# Altium schematic sheet 2 - FPGA.SchDoc
size A3; PageSetup: Record=PageOptions|CenterHorizontal=True|CenterVertical=True|PrintScale=0.98|XCorrection=1.00|YCorrection=1.00|PrintKind=1|BorderSize=5000000|LeftOffset=0|BottomOffset=0|Orientation=2|PaperLength=1000|PaperWidth=1000|Scale=100|PaperSource=7|PrintQuality=-4|MediaType=1|DitherType=10|PaperKind=A4 (210 x 297 mm)|PrintScaleMode=1
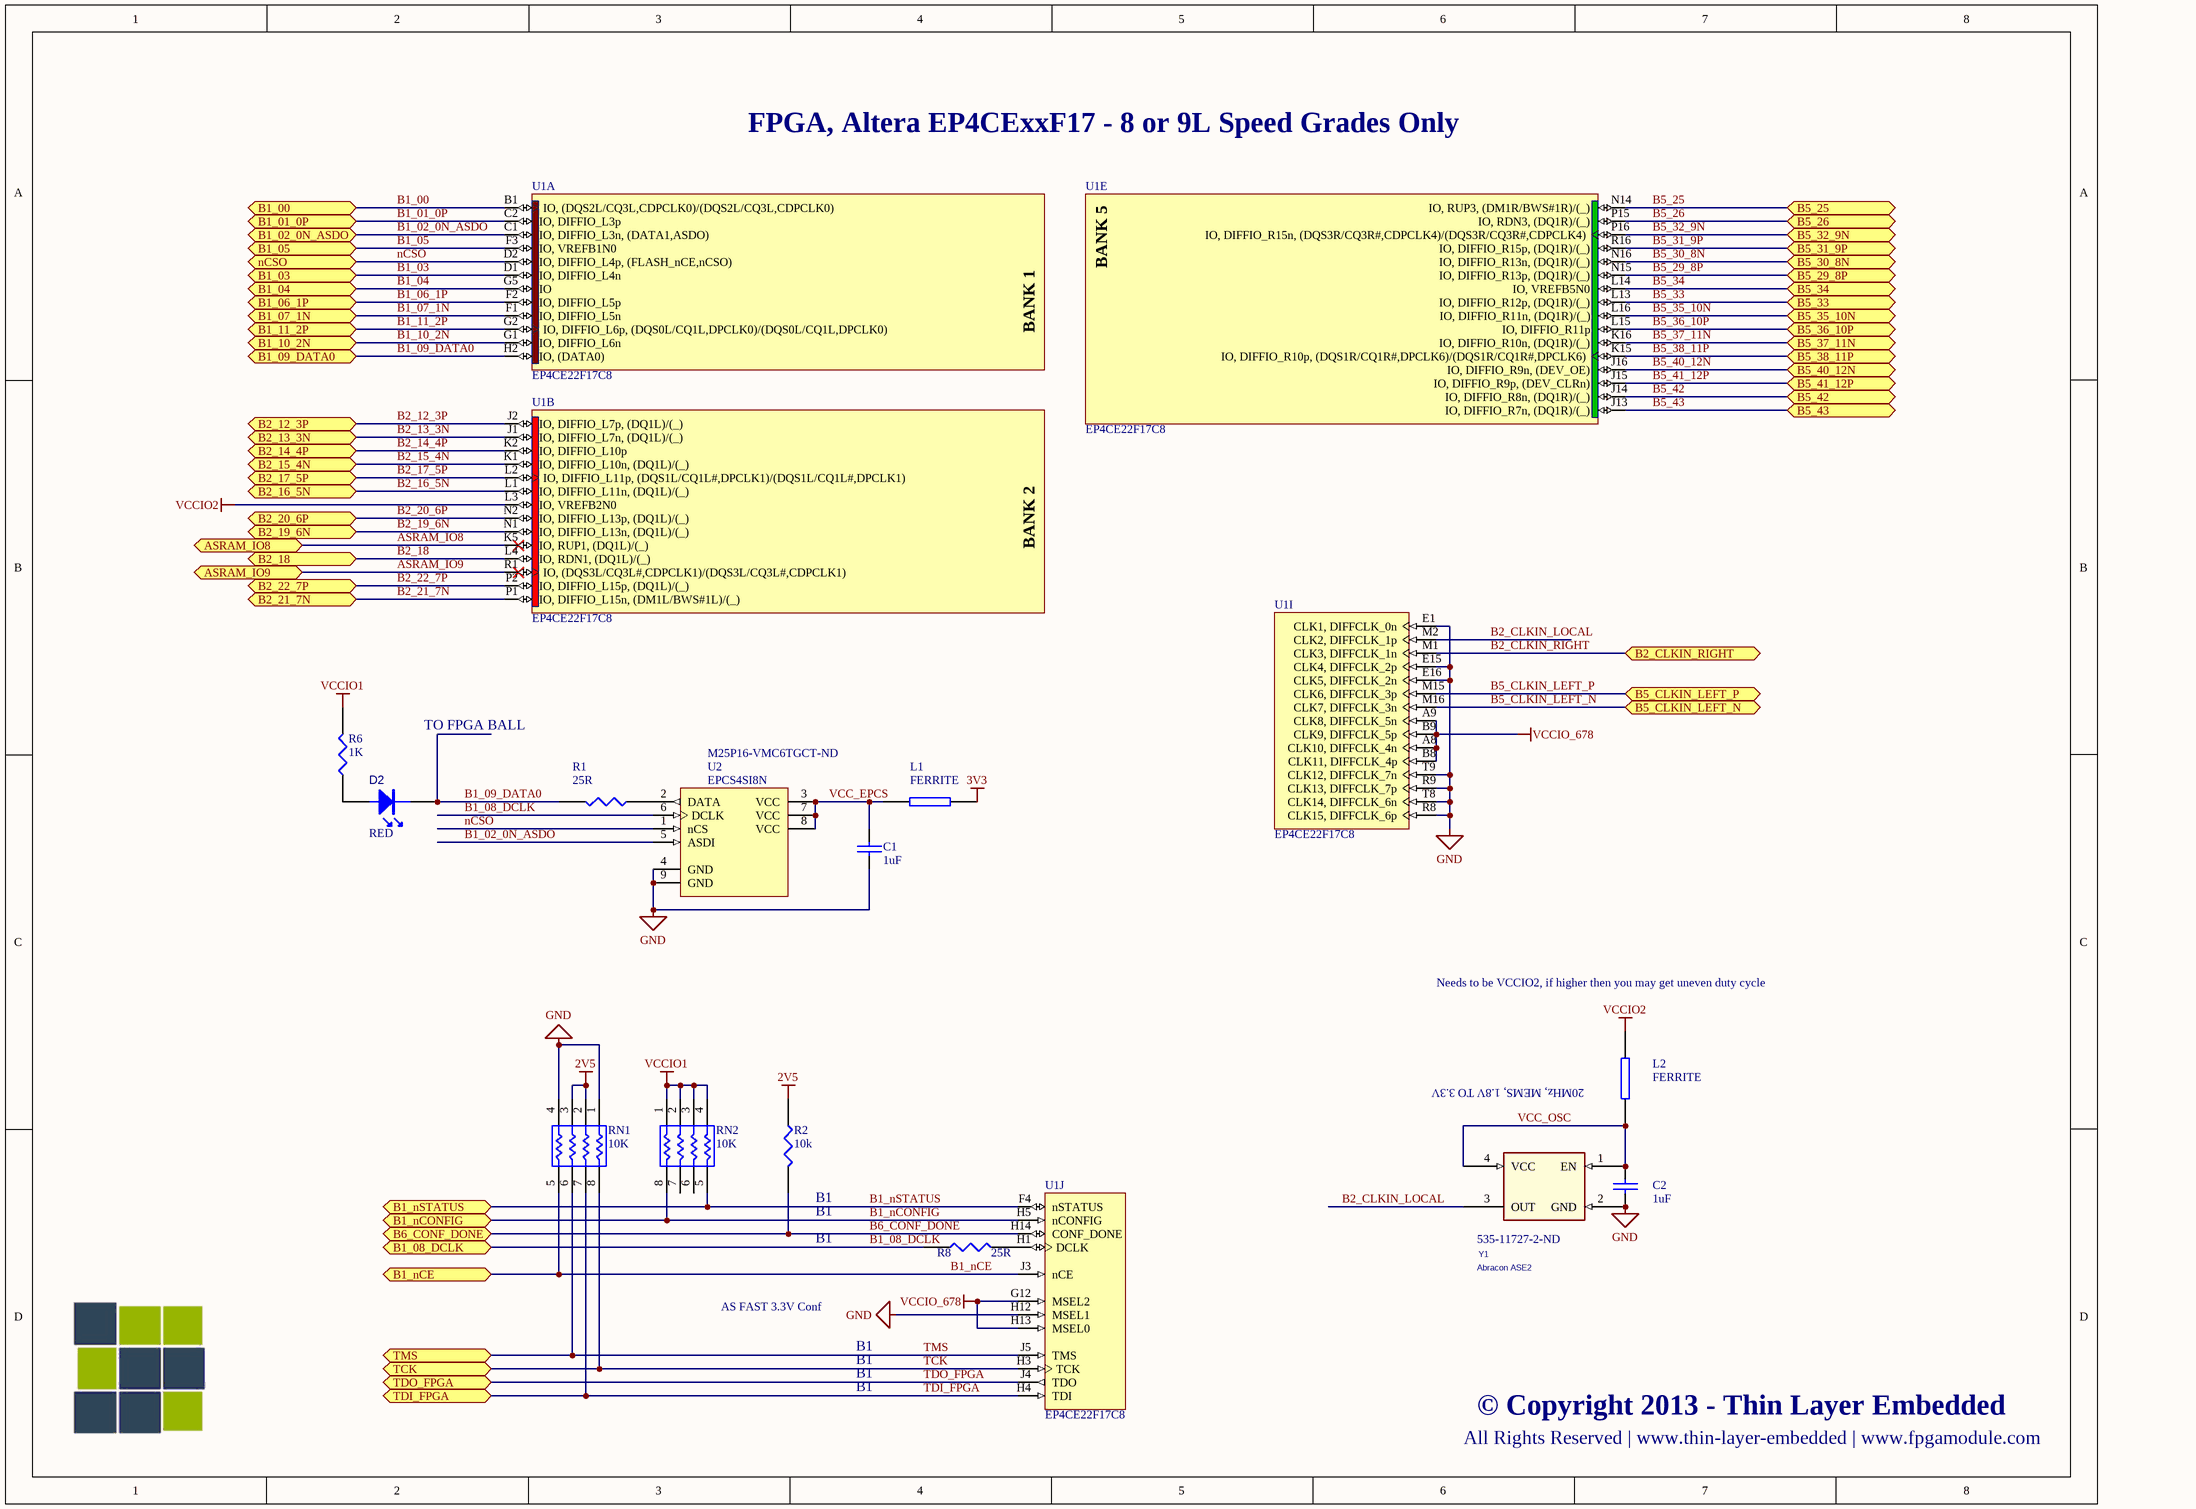
[diagram p0: 2 - FPGA.SchDoc]

## Parts
C1  1uF  [0402_hd]
C2  1uF  [0402_hd]
D2  RED  [0402LED_HD]
L1  FERRITE  [0402_HD]
L2  FERRITE  [0402_HD]
R1  25R  [0402_HD]
R2  10k  [0402_HD]
R6  1K  [0402_HD]
R8  25R  [0402_HD]
RN1  10K  [0402x4_hd]
RN2  10K  [0402x4_hd]
U1  EP4CE22F17C8  [FBGA256]  (parts A,B,E,I,J of 13)
U2  EPCS4SI8N  Supplier Part Number 1: M25P16-VMC6TGCT-ND  [UFDFPN8_4X3]
Y1  Abracon ASE2  Supplier Part Number 1: 535-11727-2-ND  [XTAL_ASDMB]

## Ports
ASRAM_IO8, ASRAM_IO9, B1_00, B1_01_0P, B1_02_0N_ASDO, B1_03, B1_04, B1_05, B1_06_1P, B1_07_1N, B1_08_DCLK, B1_09_DATA0, B1_10_2N, B1_11_2P, B1_nCE, B1_nCONFIG, B1_nSTATUS, B2_12_3P, B2_13_3N, B2_14_4P, B2_15_4N, B2_16_5N, B2_17_5P, B2_18, B2_19_6N, B2_20_6P, B2_21_7N, B2_22_7P, B2_CLKIN_RIGHT, B5_25, B5_26, B5_29_8P, B5_30_8N, B5_31_9P, B5_32_9N, B5_33, B5_34, B5_35_10N, B5_36_10P, B5_37_11N, B5_38_11P, B5_40_12N, B5_41_12P, B5_42, B5_43, B5_CLKIN_LEFT_N, B5_CLKIN_LEFT_P, B6_CONF_DONE, nCSO, TCK, TDI_FPGA, TDO_FPGA, TMS

## Nets
2V5: R2.2 RN1.2 RN1.3
3V3: L1.2
GND: C1.2 C2.2 RN1.1 RN1.4 U1.E1(CLK1,_DIFFCLK_0n) U1.E15(CLK4,_DIFFCLK_2p) U1.E16(CLK5,_DIFFCLK_2n) U1.H12(MSEL1) U1.R8(CLK15,_DIFFCLK_6p) U1.R9(CLK13,_DIFFCLK_7p) U1.T8(CLK14,_DIFFCLK_6n) U1.T9(CLK12,_DIFFCLK_7n) U2.4(GND) U2.9(GND) Y1.2(GND)
VCCIO1: R6.1 RN2.1 RN2.2 RN2.3 RN2.4
VCCIO2: L2.2 U1.L3(IO,_VREFB2N0)
VCCIO_678: U1.A8(CLK10,_DIFFCLK_4n) U1.A9(CLK8,_DIFFCLK_5n) U1.B8(CLK11,_DIFFCLK_4p) U1.B9(CLK9,_DIFFCLK_5p) U1.G12(MSEL2) U1.H13(MSEL0)
ASRAM_IO8: U1.K5(IO,_RUP1,_(DQ1L)/(_)) ; port ASRAM_IO8
ASRAM_IO9: U1.R1(IO,_(DQS3L/CQ3L#,CDPCLK1)/(DQS3L/CQ3L#,CDPCLK1)) ; port ASRAM_IO9
B1_00: U1.B1(IO,_(DQS2L/CQ3L,CDPCLK0)/(DQS2L/CQ3L,CDPCLK0)) ; port B1_00
B1_01_0P: U1.C2(IO,_DIFFIO_L3p) ; port B1_01_0P
B1_02_0N_ASDO: U1.C1(IO,_DIFFIO_L3n,_(DATA1,ASDO)) U2.5(ASDI) ; port B1_02_0N_ASDO
B1_03: U1.D1(IO,_DIFFIO_L4n) ; port B1_03
B1_04: U1.G5(IO) ; port B1_04
B1_05: U1.F3(IO,_VREFB1N0) ; port B1_05
B1_06_1P: U1.F2(IO,_DIFFIO_L5p) ; port B1_06_1P
B1_07_1N: U1.F1(IO,_DIFFIO_L5n) ; port B1_07_1N
B1_08_DCLK: R8.1 U2.6(DCLK) ; port B1_08_DCLK
B1_09_DATA0: D2.K R1.1 U1.H2(IO,_(DATA0)) ; port B1_09_DATA0
B1_10_2N: U1.G1(IO,_DIFFIO_L6n) ; port B1_10_2N
B1_11_2P: U1.G2(IO,_DIFFIO_L6p,_(DQS0L/CQ1L,DPCLK0)/(DQS0L/CQ1L,DPCLK0)) ; port B1_11_2P
B1_nCE: RN1.5 U1.J3(nCE) ; port B1_nCE
B1_nCONFIG: RN2.8 U1.H5(nCONFIG) ; port B1_nCONFIG
B1_nSTATUS: RN2.5 U1.F4(nSTATUS) ; port B1_nSTATUS
B2_12_3P: U1.J2(IO,_DIFFIO_L7p,_(DQ1L)/(_)) ; port B2_12_3P
B2_13_3N: U1.J1(IO,_DIFFIO_L7n,_(DQ1L)/(_)) ; port B2_13_3N
B2_14_4P: U1.K2(IO,_DIFFIO_L10p) ; port B2_14_4P
B2_15_4N: U1.K1(IO,_DIFFIO_L10n,_(DQ1L)/(_)) ; port B2_15_4N
B2_16_5N: U1.L1(IO,_DIFFIO_L11n,_(DQ1L)/(_)) ; port B2_16_5N
B2_17_5P: U1.L2(IO,_DIFFIO_L11p,_(DQS1L/CQ1L#,DPCLK1)/(DQS1L/CQ1L#,DPCLK1)) ; port B2_17_5P
B2_18: U1.L4(IO,_RDN1,_(DQ1L)/(_)) ; port B2_18
B2_19_6N: U1.N1(IO,_DIFFIO_L13n,_(DQ1L)/(_)) ; port B2_19_6N
B2_20_6P: U1.N2(IO,_DIFFIO_L13p,_(DQ1L)/(_)) ; port B2_20_6P
B2_21_7N: U1.P1(IO,_DIFFIO_L15n,_(DM1L/BWS#1L)/(_)) ; port B2_21_7N
B2_22_7P: U1.P2(IO,_DIFFIO_L15p,_(DQ1L)/(_)) ; port B2_22_7P
B2_CLKIN_LOCAL: U1.M2(CLK2,_DIFFCLK_1p) Y1.3(OUT)
B2_CLKIN_RIGHT: U1.M1(CLK3,_DIFFCLK_1n) ; port B2_CLKIN_RIGHT
B5_25: U1.N14(IO,_RUP3,_(DM1R/BWS#1R)/(_)) ; port B5_25
B5_26: U1.P15(IO,_RDN3,_(DQ1R)/(_)) ; port B5_26
B5_29_8P: U1.N15(IO,_DIFFIO_R13p,_(DQ1R)/(_)) ; port B5_29_8P
B5_30_8N: U1.N16(IO,_DIFFIO_R13n,_(DQ1R)/(_)) ; port B5_30_8N
B5_31_9P: U1.R16(IO,_DIFFIO_R15p,_(DQ1R)/(_)) ; port B5_31_9P
B5_32_9N: U1.P16(IO,_DIFFIO_R15n,_(DQS3R/CQ3R#,CDPCLK4)/(DQS3R/CQ3R#,CDPCLK4)) ; port B5_32_9N
B5_33: U1.L13(IO,_DIFFIO_R12p,_(DQ1R)/(_)) ; port B5_33
B5_34: U1.L14(IO,_VREFB5N0) ; port B5_34
B5_35_10N: U1.L16(IO,_DIFFIO_R11n,_(DQ1R)/(_)) ; port B5_35_10N
B5_36_10P: U1.L15(IO,_DIFFIO_R11p) ; port B5_36_10P
B5_37_11N: U1.K16(IO,_DIFFIO_R10n,_(DQ1R)/(_)) ; port B5_37_11N
B5_38_11P: U1.K15(IO,_DIFFIO_R10p,_(DQS1R/CQ1R#,DPCLK6)/(DQS1R/CQ1R#,DPCLK6)) ; port B5_38_11P
B5_40_12N: U1.J16(IO,_DIFFIO_R9n,_(DEV_OE)) ; port B5_40_12N
B5_41_12P: U1.J15(IO,_DIFFIO_R9p,_(DEV_CLRn)) ; port B5_41_12P
B5_42: U1.J14(IO,_DIFFIO_R8n,_(DQ1R)/(_)) ; port B5_42
B5_43: U1.J13(IO,_DIFFIO_R7n,_(DQ1R)/(_)) ; port B5_43
B5_CLKIN_LEFT_N: U1.M16(CLK7,_DIFFCLK_3n) ; port B5_CLKIN_LEFT_N
B5_CLKIN_LEFT_P: U1.M15(CLK6,_DIFFCLK_3p) ; port B5_CLKIN_LEFT_P
B6_CONF_DONE: R2.1 U1.H14(CONF_DONE) ; port B6_CONF_DONE
nCSO: U1.D2(IO,_DIFFIO_L4p,_(FLASH_nCE,nCSO)) U2.1(nCS) ; port nCSO
TCK: RN1.8 U1.H3(TCK) ; port TCK
TDI_FPGA: RN1.7 U1.H4(TDI) ; port TDI_FPGA
TDO_FPGA: U1.J4(TDO) ; port TDO_FPGA
TMS: RN1.6 U1.J5(TMS) ; port TMS
VCC_EPCS: C1.1 L1.1 U2.3(VCC) U2.7(VCC) U2.8(VCC)
VCC_OSC: C2.1 L2.1 Y1.1(EN) Y1.4(VCC)
NetD2_A: D2.A R6.2
NetR1_2: R1.2 U2.2(DATA)
NetR8_2: R8.2 U1.H1(DCLK)

Not connected (* = marked no-connect by the designer): RN2 6 7(17)

## Notes on the sheet
- FPGA, Altera EP4CExxF17 - 8 or 9L Speed Grades Only
- TO FPGA BALL
- Needs to be VCCIO2, if higher then you may get uneven duty cycle
- (near L2) 20MHz, MEMS, 1.8V TO 3.3V
- B1
- (near R2) B1
- AS FAST 3.3V Conf
- All Rights Reserved | www.thin-layer-embedded | www.fpgamodule.com
- © Copyright 2013 - Thin Layer Embedded
- (in symbol EP4CE22F17C8, part A) BANK 1
- (in symbol EP4CE22F17C8, part B) BANK 2
- (in symbol EP4CE22F17C8, part E) BANK 5

## Library data of the parts
C1 C2 = CAP: Capacitor
  C2: Supplier 1: Digi-Key; Supplier Part Number 1: 587-1231-2-ND
D2 = LED
R1 R2 R8 = RES1: Manufacturer: Yageo; Manufacturer Part Number: RC0402FR-0724R9L; Description: RES 24.9 OHM 1/16W 1% 0402 SMD; Resistance (Ohms): 24.9; Power (Watts): 0.063W, 1/16W; Temperature Coefficient: ±100ppm/°C; Tolerance: ±1%; Supplier 1: Digi-Key; RoHS: RoHS Compliant; Category: Resistors; Stock 1: 237555; Pricing 1: 10=0.014, 50=0.0104, 100=0.0079, 250=0.00584, 500=0.00432, 1000=0.00288 (USD); Composition: Thick Film; Features: -; Size / Dimension: 0.039" L x 0.020" W (1.00mm x 0.50mm); Height: 0.014" (0.35mm); Number of Terminations: 2; Packaging: Cut Tape (CT); Package / Case: 0402 (1005 Metric); ComponentLink1URL: http://www.yageo.com/documents/recent/PYu-RC0402_51_RoHS_L_6.pdf; ComponentLink1Description: http://www.yageo.com/documents/recent/PYu-RC0402_51_RoHS_L_6.pdf
  R1: Supplier 2: Digi-Key; Supplier Part Number 2: 311-24.9HRCT-ND; Stock 2: 302870; Pricing 2: 10=0.014, 50=0.0104, 100=0.0079, 250=0.00584, 500=0.00432, 1000=0.00288 (USD); ComponentLink2URL: http://www.yageo.com/documents/recent/PYu-RC0603_51_RoHS_L_4.pdf; ComponentLink2Description: http://www.yageo.com/documents/recent/PYu-RC0603_51_RoHS_L_4.pdf
  R2: Supplier 2: Digi-Key; Stock 2: 302870; Pricing 2: 10=0.014, 50=0.0104, 100=0.0079, 250=0.00584, 500=0.00432, 1000=0.00288 (USD); ComponentLink2URL: http://www.yageo.com/documents/recent/PYu-RC0603_51_RoHS_L_4.pdf; ComponentLink2Description: http://www.yageo.com/documents/recent/PYu-RC0603_51_RoHS_L_4.pdf
  R8: Supplier Part Number 1: 311-24.9LRCT-ND
R6 = RES1
RN1 RN2 = RESNET1
U1 = EP4CE22F17C8: Cyclone IV Family FPGA, 2V Core, 153 I/O Pins, 4 PLLs, 256-Pin FBGA, Speed Grade 8, Commercial Grade; Published: 3-May-2010; DatasheetVersion: ver1.2, Mar-2010; PackageVersion: ver16.0, Dec-2009; PackageReference: FBGA256; Publisher: Altium Limited; PackageDescription: 256-Ball FineLine Ball Grid Array (FBGA256) - Option 1 - Wire Bond; Code_JEDEC: MS-034-AAF-1; Code_IPC: BGA100P16X16-256; ComponentLink1Description: Manufacturer Link; ComponentLink1URL: http://www.altera.com/; ComponentLink2Description: Handbook; ComponentLink2URL: http://www.altera.com/literature/hb/cyclone-iv/cyclone4-handbook.pdf; ComponentLink3Description: Pinout Specification; ComponentLink3URL: http://www.altera.com/literature/lit-dp.jsp?category=cyc%204&showspreadsheet=y; ComponentLink4Description: Packaging Specification; ComponentLink4URL: http://www.altera.com/literature/ds/dspkg.pdf
U2 = EPCS4SI8N: EPCS4 Series, In-system programmable 3.3V serial configuration device, 8-Pin SOIC, 4-Megabit, Industrial Grade, Pb-Free; Manufacturer: Numonyx - A DIVISION OF MICRON SEMICONDUCTOR PRODUCTS, INC.; Manufacturer Part Number: M25P16-VMC6TG; Configures: Cyclone II, Stratix II, & Cyclone Devices; Description: IC SRL FLASH 16MBIT 75MHZ MLP8; Format - Memory: FLASH; Memory Size: 16M (2M x 8); Speed: 75MHz; Interface: SPI, 3-Wire Serial; Voltage - Supply: 2.7 V ~ 3.6 V; Published: 4-Mar-2005; LatestRevisionDate: 13-Apr-2006; LatestRevisionNote: IPC-7351 Footprint Added.; DatasheetVersion: ver2.0, Oct-2003; PackageVersion: ver13.0, May-2005; PackageReference: SOIC8; Publisher: Altium Limited; PackageDescription: 8-Pin Small Outline Integrated Circuit Package (SOIC8); Code_JEDEC: MS-012-AA; Code_IPC: SOIC127P600-8; ComponentLink1Description: Manufacturer Link; ComponentLink1URL: http://www.altera.com/products/devices/config/cfg-index.html; ComponentLink2Description: Configuration Handbook; ComponentLink2URL: http://www.altera.com/literature/hb/cfg/config_handbook.pdf; ComponentLink3Description: Pinout Specification; ComponentLink3URL: http://www.altera.com/literature/hb/cfg/cyc_c51014.pdf; ComponentLink4Description: Packaging Specification; ComponentLink4URL: http://www.altera.com/literature/ds/dspkg.pdf; Supplier 1: Digi-Key; RoHS: RoHS Compliant; Category: Integrated Circuits (ICs); Stock 1: 6116; Pricing 1: 1=2, 10=1.71, 25=1.5392, 100=1.3965, 250=1.254, 500=1.083, 1000=0.912 (USD); Memory Type: FLASH; Operating Temperature: -40°C ~ 85°C; Package / Case: 8-UDFN; Supplier Device Package: 8-UFDFPN; Packaging: Cut Tape (CT); ComponentLink5URL: http://media.digikey.com/pdf/Data%20Sheets/Numonyx,Intel/M25P16.pdf; ComponentLink5Description: http://media.digikey.com/pdf/Data%20Sheets/Numonyx,Intel/M25P16.pdf
Y1 = OSC_ALT: OSC - 50MHZ, +/-50PPM, 1.8V, CMOS CLOCK OSCILLATOR, SMD; Manufacturer Part Num: SM5545TEX-50.00M; Manufacturer: Pletronics; Part Class: Oscillators; Num Pins: 4; Item Num: P13-26191R; RoHS Compliant: Yes; Lead Free Status: No; Supplier 1: Digi-Key